# EAGLE schematic OpenAT_Switch_Latch (EAGLE 9.6.2)
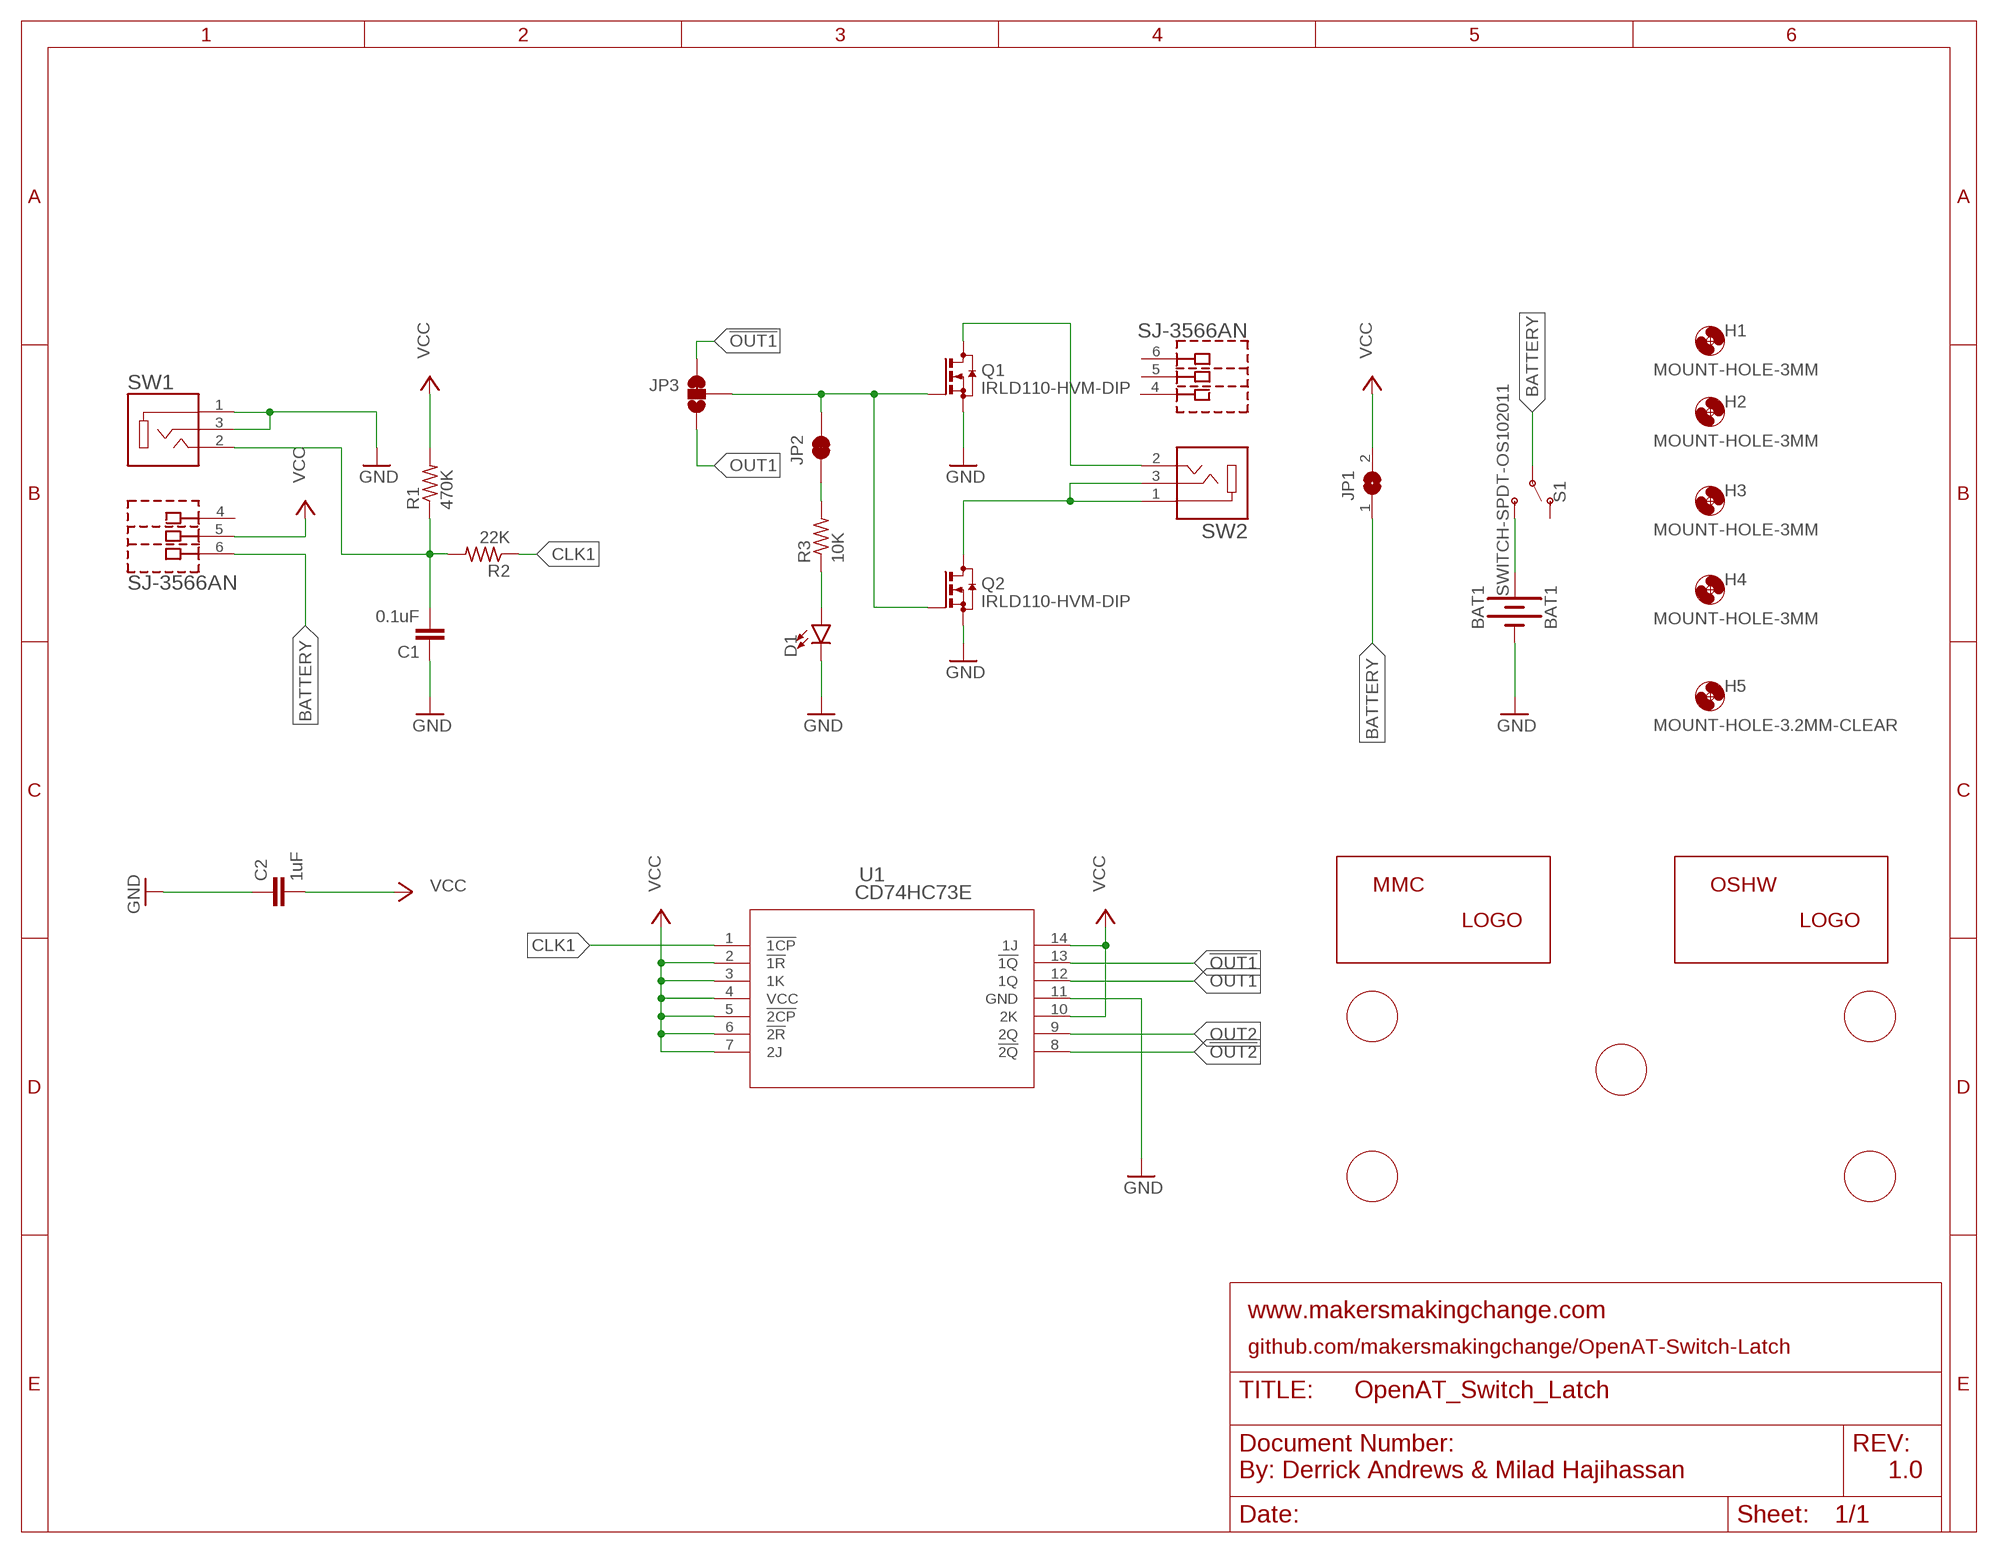
[diagram p0: schematic, sheet 1]

## Parts
BAT1  BAT1  BATTERY-20MM_PTH  [BATTCOM_20MM_PTH]
C1  0.1uF  CAPACITOR-050-030-075  [CAP-050-030X075]
C2  1uF  CAPACITOR-050-030-075  [CAP-050-030X075]
D1  LED_5MM-5MM-GREEN  [LED_5MM_GREEN]
H1  MOUNT-HOLE-3MM  [HOLE-3MM]
H2  MOUNT-HOLE-3MM  [HOLE-3MM]
H3  MOUNT-HOLE-3MM  [HOLE-3MM]
H4  MOUNT-HOLE-3MM  [HOLE-3MM]
H5  MOUNT-HOLE-3.2MM-CLEAR  [HOLE-3.2MM-CLEAR]
JP1  SOLDERJUMPEROPENED  [SOLDERJUMPER_OPENED_TRACE_SILK]
JP2  JUMPERS-SMT_2_NC_TRACE_SILK  [JUMPERS_SMT-JUMPER_2_NC_TRACE_SILK]
JP3  JUMPERS-SMT_3_1-NC_TRACE_SILK  [JUMPERS_SMT-JUMPER_3_1-NC_TRACE_SILK]
LABEL_INPUT  MMC_LABEL-SW-INPUT  [LABEL-INPUT]
LABEL_LOGO  MMC_LOGO-SM  [MMC_SMALL_LOGO]
LABEL_OUTPUT  MMC_LABEL-SW-OUTPUT  [LABEL-OUTPUT]
Q1  IRLD110-HVM-DIP  [HVM-DIP]
Q2  IRLD110-HVM-DIP  [HVM-DIP]
R1  470K  RESISTOR-US-0204/5  [RESISTOR_0204/5]
R2  22K  RESISTOR-US-0204/5  [RESISTOR_0204/5]
R3  10K  RESISTOR-US-0204/5  [RESISTOR_0204/5]
S1  SWITCH-SPDT-OS102011  [SWITCH_SPDT_11MA1QS1]
SW1  SJ-3566AN  [CUI_SJ-3566AN]
SW2  SJ-3566AN  [CUI_SJ-3566AN]
U1  CD74HC73E  [14-DIP]
U$1  OSHW_LOGO-XSM  [OSHW_X-SMALL_LOGO]
U$2  MMC_LABEL-OPENAT  [LABEL-OPENAT]
U$3  MMC_LABEL-SWITCH-LATCH  [LABEL-SWITCH-LATCH]
U$4  MMC_LABEL-V1.0  [LABEL-V1.0]

## Nets
!OUT1: JP3.1 U1.13(!1Q)
!OUT2: U1.8(!2Q)
BATTERY: JP1.1 S1.2(P) SW1.6
CLK1: R2.1 U1.1(!1CP)
GND: BAT1.- C1.1 C2.1 D1.K(C) Q1.2(S) Q2.2(S) SW1.1 SW1.3 U1.11(GND)
N$1: BAT1.+ S1.3(S)
N$5: JP2.1 R3.2
N$6: D1.A R3.1
N$7: Q2.3(D) SW2.1 SW2.3
N$8: Q1.3(D) SW2.2
N$15: C1.2 R1.1 R2.2 SW1.2
OUT1: JP3.3 U1.12(1Q)
OUT1-SELECT: JP2.2 JP3.2 Q1.1(G) Q2.1(G)
OUT2: U1.9(2Q)
VCC: C2.2 JP1.2 R1.2 SW1.5 U1.2(!1R) U1.3(1K) U1.4(VCC) U1.5(!2CP) U1.6(!2R) U1.7(2J) U1.10(2K) U1.14(1J)
Unconnected: S1.1(O) SW1.4 SW2.4 SW2.5 SW2.6

## Notes on the sheet
- www.makersmakingchange.com
- github.com/makersmakingchange/OpenAT-Switch-Latch
- By: Derrick Andrews & Milad Hajihassan | 1.0

## Library data of the parts
BAT1 = MMC Eagle:BATTERY-: BATTERY HOLDER COIN 20MM SMD - Manufacturer Product Number: BU2032SM-BT-GTR
C1 C2 = MMC Eagle:CAPACITOR-
D1 = MMC Eagle:LED_5MM-: LED (Generic) Standard schematic elements and footprints for 5mm, 3mm, 1206, and 0603 sized LEDs. Generic LEDs with no color specified.
H1-H5 = MMC Eagle:MOUNT-HOLE-: MOUNTING HOLE with drill center marker
JP1 = MMC_SMD:SOLDERJUMPER: SMD Solder JUMPER Solder the two pads together to create a connection, or remove the solder to break it. REFLOW - Use this footprint for solder paste and reflow ovens. WAVE - Use this footprint for hand-soldering (larger pads). CLOSED - Has a trace between the two pads to ensure it is closed by default. The trace needs to be cut to disable the jumper, and can be closed again by creating a solder bridge between the two pads.
JP2 = MMC_SMD:JUMPERS-SMT_2_NC_TRACE: Normally closed trace jumper This jumper has a trace between two pads so it's normally closed (NC). Use a razor knife to open the connection. For best results follow the IPC guidelines for cutting traces: Cutout at least 0.063 mm (0.005 in). Remove all loose material to clean up the cut area. Seal the cut with an approved epoxy. Reapply solder to reclose the connection.
JP3 = MMC_SMD:JUMPERS-SMT_3_1-NC_TRACE: Normally closed trace jumper (2 of 2 connections) This jumper has a trace between all three pads so they are normally closed (NC). Use a razor knife to open the connection(s). For best results follow the IPC guidelines for cutting traces: Cutout at least 0.063 mm (0.005 in). Remove all loose material to clean up the cut area. Seal the cut with an approved epoxy. Reapply solder to reclose the connection(s).
LABEL_INPUT LABEL_OUTPUT U$2-U$4 = MMC Eagle:MMC_LABEL-
LABEL_LOGO = MMC Eagle:MMC_LOGO-
Q1 Q2 = MMC Eagle:IRLD110: IRLD110 MOSFET N-Channel 100 V 1A (Ta) 1.3W (Ta) Through Hole 4-DIP. Options: Digikey - IRLD110PBF-ND <https://www.digikey.ca/en/products/detail/vishay-siliconix/IRLD110PBF/812489> Mouser - 844-IRLD110PBF <https://www.mouser.ca/ProductDetail/Vishay-Siliconix/IRLD110PBF?qs=%2Fha2pyFadujwuTBhAnxnNK4HZG7KHsMVk02RHG1e2aB4YKluueK%2FDA%3D%3D>
R1-R3 = MMC Eagle:RESISTOR-US-: RESISTOR, American symbol
S1 = MMC Eagle:SWITCH-SPDT-
SW1 SW2 = MMC Eagle:SJ-3566AN: Audio Jack Connector 3.5 mm Right-Angle Stereo Jack w/ SPDT Switch; CUI_PURCHASE_URL: https://www.cuidevices.com/product/interconnect/connectors/audio-connectors/jacks/sj-356xn-series?utm_source=snapeda.com&utm_medium=referral&utm_campaign=snapedaBOM; DESCRIPTION: 3.5 mm, Stereo, Right Angle, Through Hole, SPDT Switch, Audio Jack Connector; DIGI-KEY_PART_NUMBER: CP-SJ-3566AN-ND; MF: CUI Devices; MP: SJ-3566AN; PACKAGE: None; PURCHASE-URL: https://pricing.snapeda.com/search/part/SJ-3566AN/?ref=eda
U1 = MMC Eagle:CD74HC73E; COPYRIGHT: Copyright (C) 2022 Ultra Librarian. All rights reserved.; DIGI-KEY_PART_NUMBER_1: 296-26013-5-ND; DIGI-KEY_PART_NUMBER_2: 2156-CD74HC73E-ND; MANUFACTURER_PART_NUMBER: CD74HC73E; MFR_NAME: Texas Instruments
U$1 = MMC Eagle:OSHW_LOGO-